# EAGLE design PIDController (EAGLE 5.10)
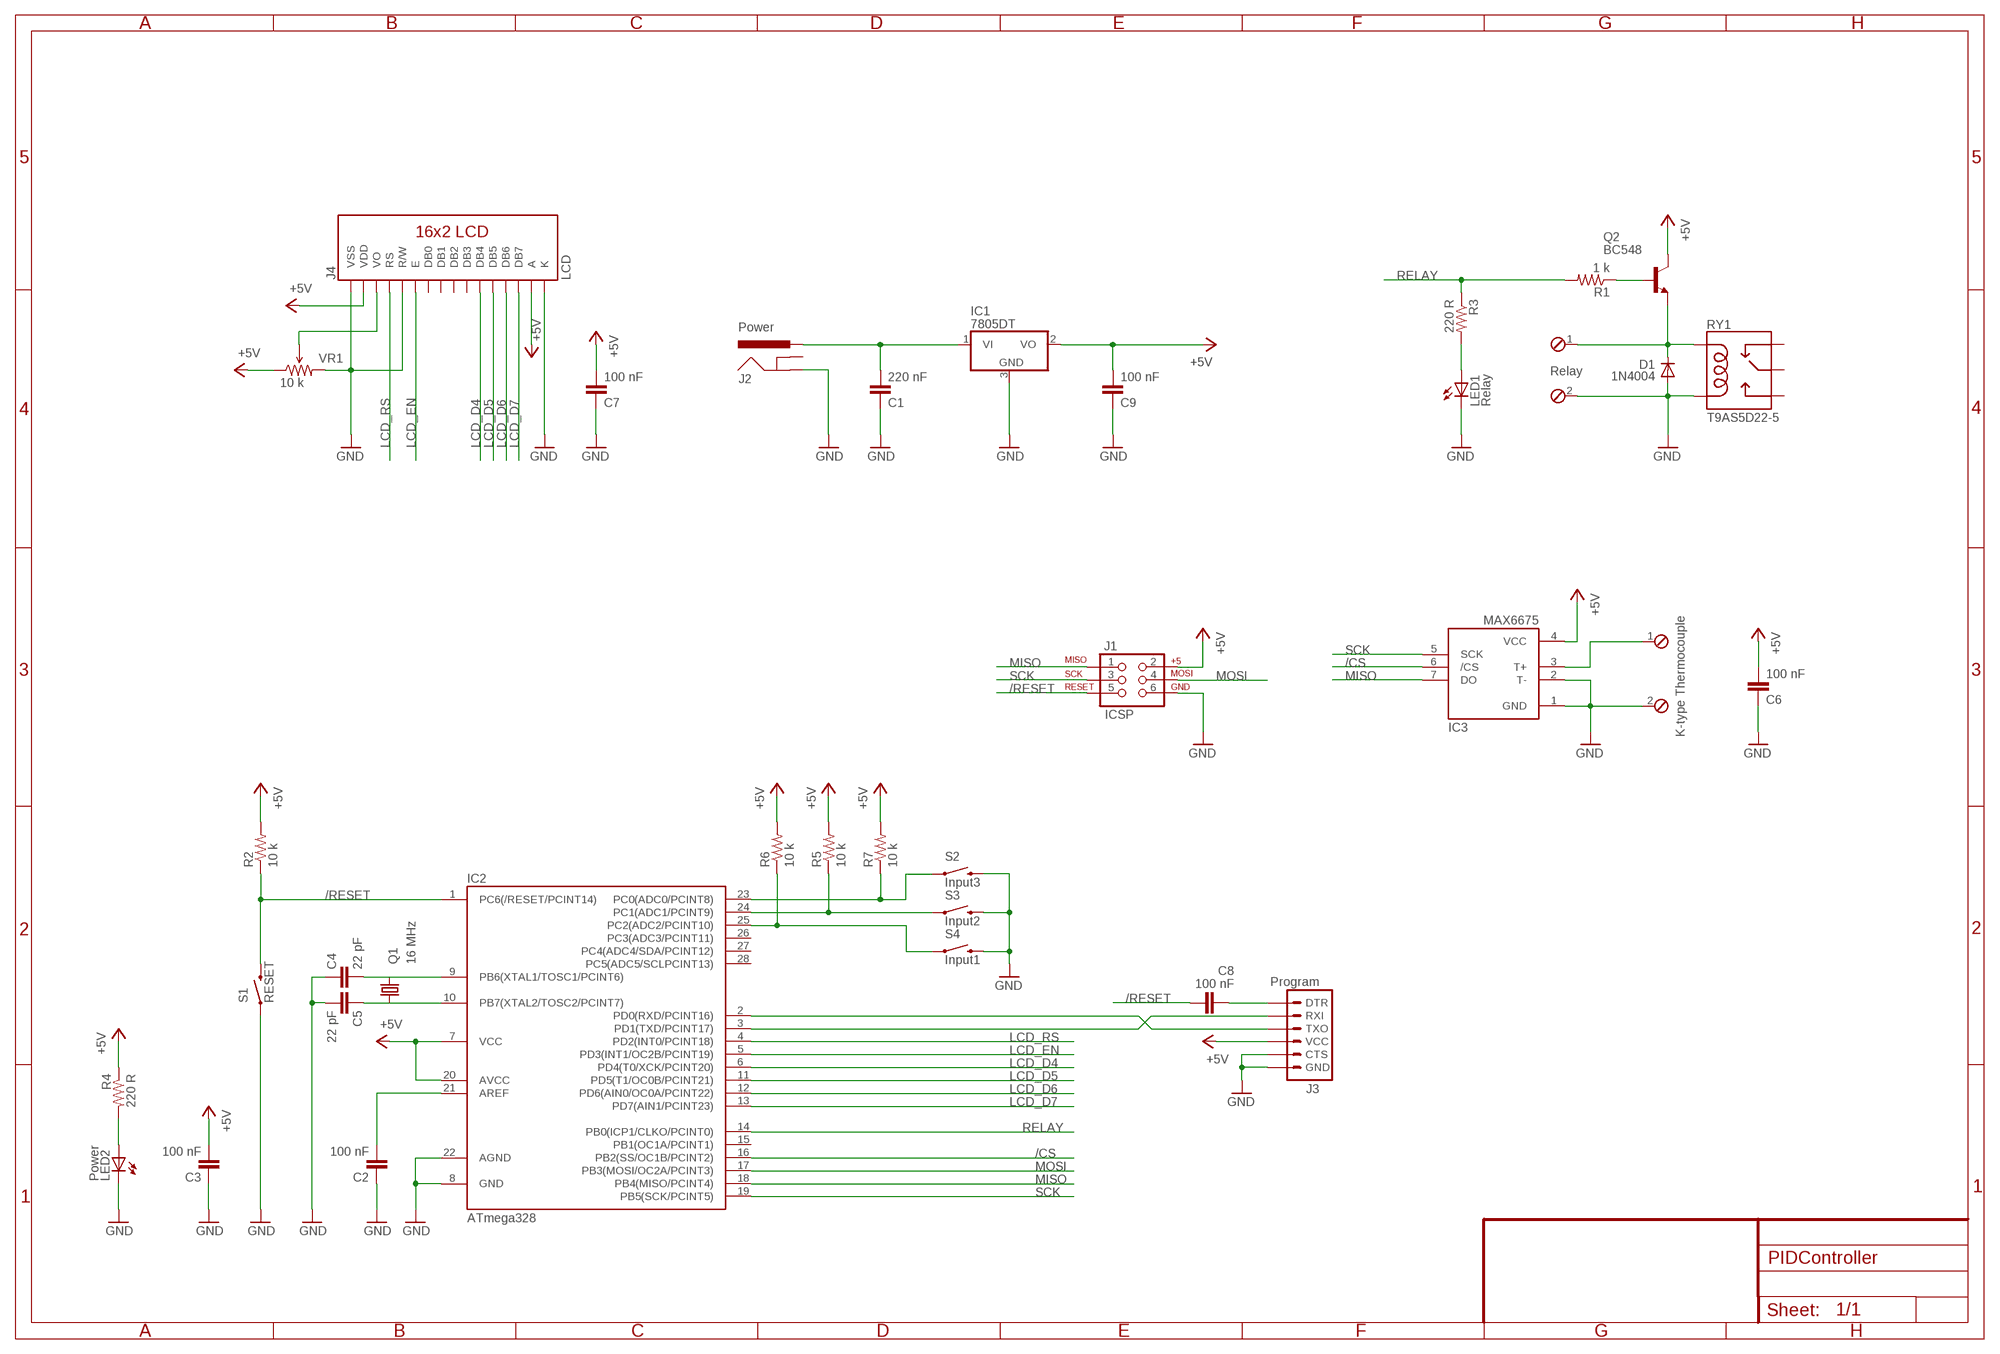
[diagram p0: schematic, sheet 1]

## Parts
C1  220 nF  C-EUC0805K  [C0805K]
C2  100 nF  C-EUC0805K  [C0805K]
C3  100 nF  C-EUC0805K  [C0805K]
C4  22 pF  C-EUC0805K  [C0805K]
C5  22 pF  C-EUC0805K  [C0805K]
C6  100 nF  C-EUC0805K  [C0805K]
C7  100 nF  C-EUC0805K  [C0805K]
C8  100 nF  C-EUC0805K  [C0805K]
C9  100 nF  C-EUC0805K  [C0805K]
D1  1N4004  DIODE-SOD123  [SOD123]
IC1  7805DT  [TO252]
IC2  ATmega328  MEGA48/88/168-PU  [DIL28-3]
IC3  MAX6675  [SO08]
J1  ICSP  AVR_SPI_PRG_6NS  [2X3-NS]
J2  Power  POWER_JACKPTH  [POWER_JACK_PTH]
J3  Program  ARDUINO_SERIAL_PROGRAMLONGPADS  [1X06_LONGPADS]
J4  LCD  LCD-16X2  [LCD-16X2]
J5  Relay  MPT2  [2POL254]
J6  K-type Thermocouple  MPT2  [2POL254]
LED1  Relay  LEDCHIP-LED0805  [CHIP-LED0805]
LED2  Power  LEDCHIP-LED0805  [CHIP-LED0805]
Q1  16 MHz  CRYSTALSMD  [HC49UP]
Q2  BC548  [TO92-EBC]
R1  1 k  R-US_M0805  [M0805]
R2  10 k  R-US_M0805  [M0805]
R3  220 R  R-US_M0805  [M0805]
R4  220 R  R-US_M0805  [M0805]
R5  10 k  R-US_M0805  [M0805]
R6  10 k  R-US_M0805  [M0805]
R7  10 k  R-US_M0805  [M0805]
RY1  T9AS5D22-5  RELAYPTH2  [RELAY-T9A]
S1  RESET  SWITCH-MOMENTARY-2SMD  [TACTILE_SWITCH_SMD]
S2  Input3  SWITCH-MOMENTARY-2SMD  [TACTILE_SWITCH_SMD]
S3  Input2  SWITCH-MOMENTARY-2SMD  [TACTILE_SWITCH_SMD]
S4  Input1  SWITCH-MOMENTARY-2SMD  [TACTILE_SWITCH_SMD]
VR1  10 k  TRIMPOTPTH  [TRIM_POT_PTH]

## Nets
+5V: C3.2 C6.2 C7.2 C9.2 IC1.2(VO) IC2.7(VCC) IC2.20(AVCC) IC3.4(VCC) J1.2 J3.4(VCC) J4.2(VDD) J4.15(A) Q2.C R2.2 R4.1 R5.2 R6.2 R7.2 VR1.1(CCW)
/CS: IC2.16(PB2(SS/OC1B/PCINT2)) IC3.6(/CS)
/RESET: C8.1 IC2.1(PC6(/RESET/PCINT14)) J1.5 R2.1 S1.3
GND: C1.1 C2.1 C3.1 C4.1 C5.2 C6.1 C7.1 C9.1 D1.A IC1.3(GND) IC2.8(GND) IC2.22(AGND) IC3.1(GND) IC3.2(T-) J1.6 J2.GND J3.5(CTS) J3.6(GND) J4.1(VSS) J4.5(R/W) J4.16(K) J5.2 J6.2 LED1.C LED2.C RY1.COIL2 S1.1 S2.3 S3.3 S4.3 VR1.3(CW)
LCD_D4: IC2.6(PD4(T0/XCK/PCINT20)) J4.11(DB4)
LCD_D5: IC2.11(PD5(T1/OC0B/PCINT21)) J4.12(DB5)
LCD_D6: IC2.12(PD6(AIN0/OC0A/PCINT22)) J4.13(DB6)
LCD_D7: IC2.13(PD7(AIN1/PCINT23)) J4.14(DB7)
LCD_EN: IC2.5(PD3(INT1/OC2B/PCINT19)) J4.6(E)
LCD_RS: IC2.4(PD2(INT0/PCINT18)) J4.4(RS)
MISO: IC2.18(PB4(MISO/PCINT4)) IC3.7(DO) J1.1
MOSI: IC2.17(PB3(MOSI/OC2A/PCINT3)) J1.4
N$1: IC2.3(PD1(TXD/PCINT17)) J3.2(RXI)
N$2: IC2.2(PD0(RXD/PCINT16)) J3.3(TXO)
N$3: IC3.3(T+) J6.1
N$4: C8.2 J3.1(DTR)
N$5: IC2.23(PC0(ADC0/PCINT8)) R7.1 S2.1
N$6: IC2.24(PC1(ADC1/PCINT9)) R5.1 S3.1
N$7: IC2.25(PC2(ADC2/PCINT10)) R6.1 S4.1
N$8: D1.C J5.1 Q2.E RY1.COIL1
N$9: Q2.B R1.1
N$10: C2.2 IC2.21(AREF)
N$11: C1.2 IC1.1(VI) J2.PWR
N$12: J4.3(VO) VR1.2(WIPER)
N$13: LED1.A R3.2
N$14: C4.2 IC2.9(PB6(XTAL1/TOSC1/PCINT6)) Q1.2
N$15: C5.1 IC2.10(PB7(XTAL2/TOSC2/PCINT7)) Q1.1
N$123: LED2.A R4.2
RELAY: IC2.14(PB0(ICP1/CLKO/PCINT0)) R1.2 R3.1
SCK: IC2.19(PB5(SCK/PCINT5)) IC3.5(SCK) J1.3
Unconnected: IC2.15(PB1(OC1A/PCINT1)) IC2.26(PC3(ADC3/PCINT11)) IC2.27(PC4(ADC4/SDA/PCINT12)) IC2.28(PC5(ADC5/SCLPCINT13)) J2.GNDBREAK J4.7(DB0) J4.8(DB1) J4.9(DB2) J4.10(DB3) RY1.MAIN RY1.NC RY1.NO

## Library data of the parts
C1-C9 = rcl:C-EU: CAPACITOR, European symbol
D1 = diode:DIODE-: DIODE
IC1 = linear:78*: Positive VOLTAGE REGULATOR Source: http://cache.national.com/ds/LM/LM78L05.pdf http://www.fairchildsemi.com/ds/LM/LM7805.pdf
IC2 = avr-5:MEGA48/88/168-PU
IC3 = adafruit:MAX6675
J1 = SparkFun:AVR_SPI_PRG_6: AVR ISP 6 Pin This is the reduced ISP connector for AVR programming. Common on Arduino. This footprint will take up less PCB space and can be used with a 10-pin to 6-pin adapter such as SKU: BOB-08508
J2 = SparkFun:POWER_JACK: Power Jack This is the standard 5.5mm barrel jack for power. The PTH is the most common, proven, reliable, footprint. All others are experimental. The Slot footprint only works if the mill layer is transmitted to the PCB fab house so be warned. Spark Fun Electronics SKU : PRT-00119. Mating wall wart : TOL-00298 (and others)
J3 = SparkFun:ARDUINO_SERIAL_PROGRAM
J4 = SparkFun:LCD-16X2
J5 J6 = con-phoenix-254:MPT2: PHOENIX CONNECTOR
LED1 LED2 = led:LED: LED OSRAM: - CHIPLED LG R971, LG N971, LY N971, LG Q971, LY Q971, LO R971, LY R971 LH N974, LH R974 LS Q976, LO Q976, LY Q976 LO Q996 - Hyper CHIPLED LW Q18S LB Q993, LB Q99A, LB R99A - SideLED LS A670, LO A670, LY A670, LG A670, LP A670 LB A673, LV A673, LT A673, LW A673 LH A674 LY A675 LS A676, LA A676, LO A676, LY A676, LW A676 LS A679, LY A679, LG A679 - Hyper Micro SIDELED® LS Y876, LA Y876, LO Y876, LY Y876 LT Y87S - SmartLED LW L88C, LW L88S LB L89C, LB L89S, LG L890 LS L89K, LO L89K, LY L89K LS L896, LA L896, LO L896, LY L896 - TOPLED LS T670, LO T670, LY T670, LG T670, LP T670 LSG T670, LSP T670, LSY T670, LOP T670, LYG T670 LG T671, LOG T671, LSG T671 LB T673, LV T673, LT T673, LW T673 LH T674 LS T676, LA T676, LO T676, LY T676, LB T676, LH T676, LSB T676, LW T676 LB T67C, LV T67C, LT T67C, LS T67K, LO T67K, LY T67K, LW E67C LS E67B, LA E67B, LO E67B, LY E67B, LB E67C, LV E67C, LT E67C LW T67C LS T679, LY T679, LG T679 LS T770, LO T770, LY T770, LG T770, LP T770 LB T773, LV T773, LT T773, LW T773 LH T774 LS E675, LA E675, LY E675, LS T675 LS T776, LA T776, LO T776, LY T776, LB T776 LHGB T686 LT T68C, LB T68C - Hyper Mini TOPLED® LB M676 - Mini TOPLED Santana® LG M470 LS M47K, LO M47K, LY M47K Source: http://www.osram.convergy.de - LUMILED® LXK2-PW12-R00, LXK2-PW12-S00, LXK2-PW14-U00, LXK2-PW14-V00 LXK2-PM12-R00, LXK2-PM12-S00, LXK2-PM14-U00 LXK2-PE12-Q00, LXK2-PE12-R00, LXK2-PE12-S00, LXK2-PE14-T00, LXK2-PE14-U00 LXK2-PB12-K00, LXK2-PB12-L00, LXK2-PB12-M00, LXK2-PB14-N00, LXK2-PB14-P00, LXK2-PB14-Q00 LXK2-PR12-L00, LXK2-PR12-M00, LXK2-PR14-Q00, LXK2-PR14-R00 LXK2-PD12-Q00, LXK2-PD12-R00, LXK2-PD12-S00 LXK2-PH12-R00, LXK2-PH12-S00 LXK2-PL12-P00, LXK2-PL12-Q00, LXK2-PL12-R00 Source: www.luxeon.com
Q1 = SparkFun:CRYSTAL: Crystals Various standard crystals. Proven footprints. Spark Fun Electronics SKU : COM-00534
Q2 = transistor-npn:BC548*: NPN Transistor
R1-R7 = resistor:R-US_: RESISTOR, American symbol
RY1 = SparkFun:RELAY
S1-S4 = SparkFun:SWITCH-MOMENTARY-2
VR1 = SparkFun:TRIMPOT

## Board
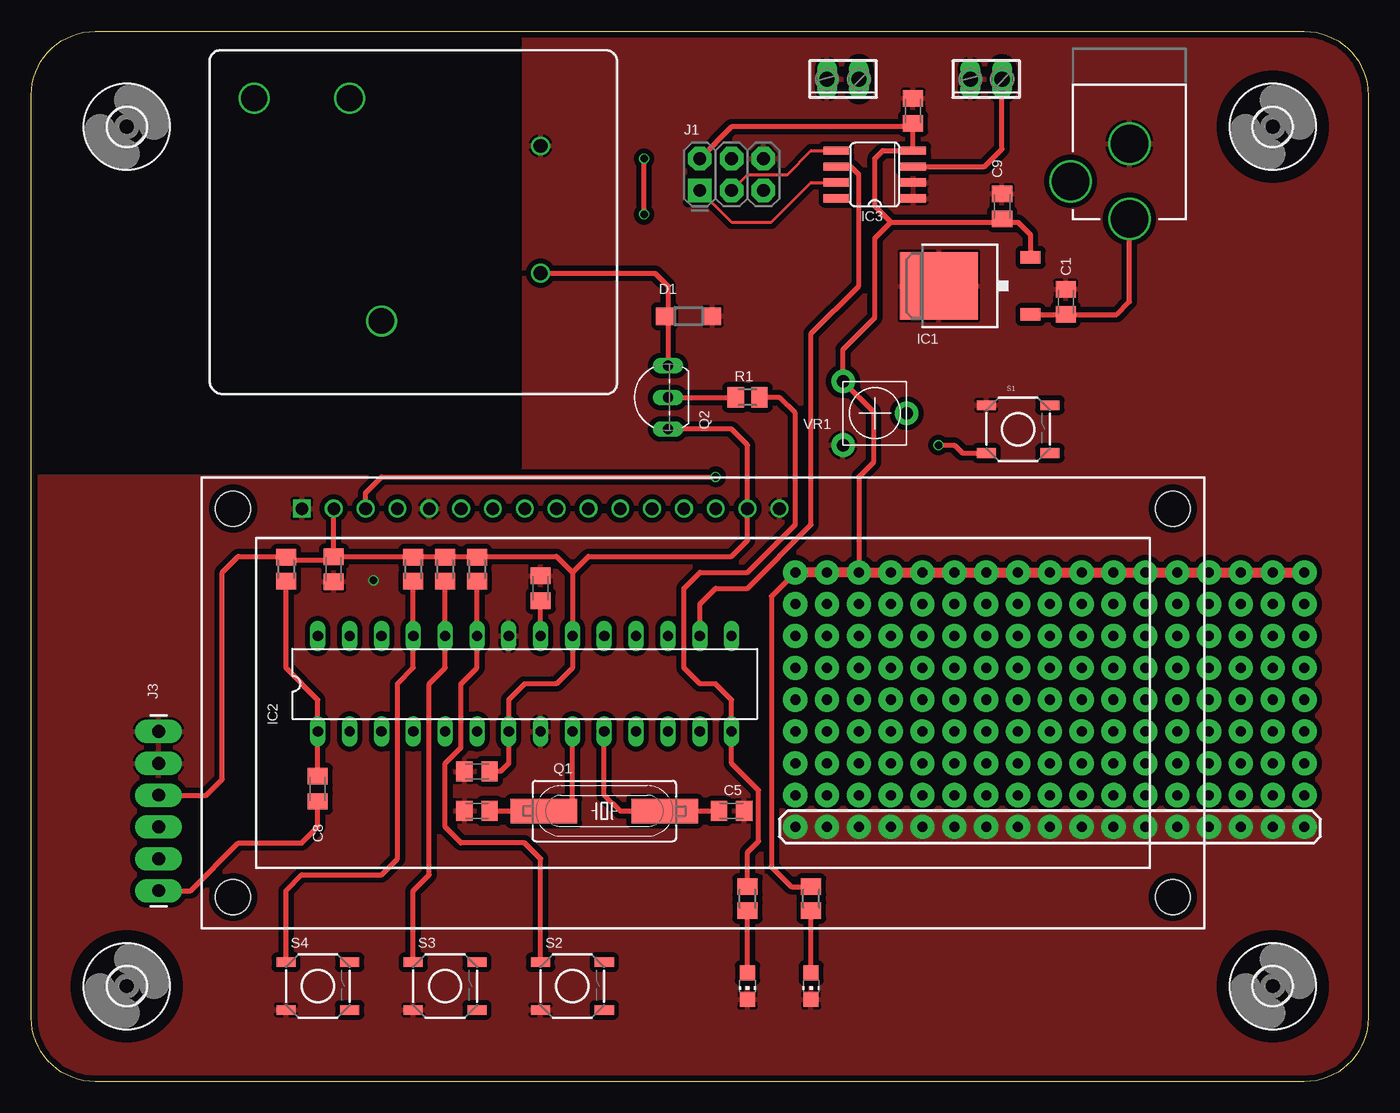
[diagram p1: board, top side]
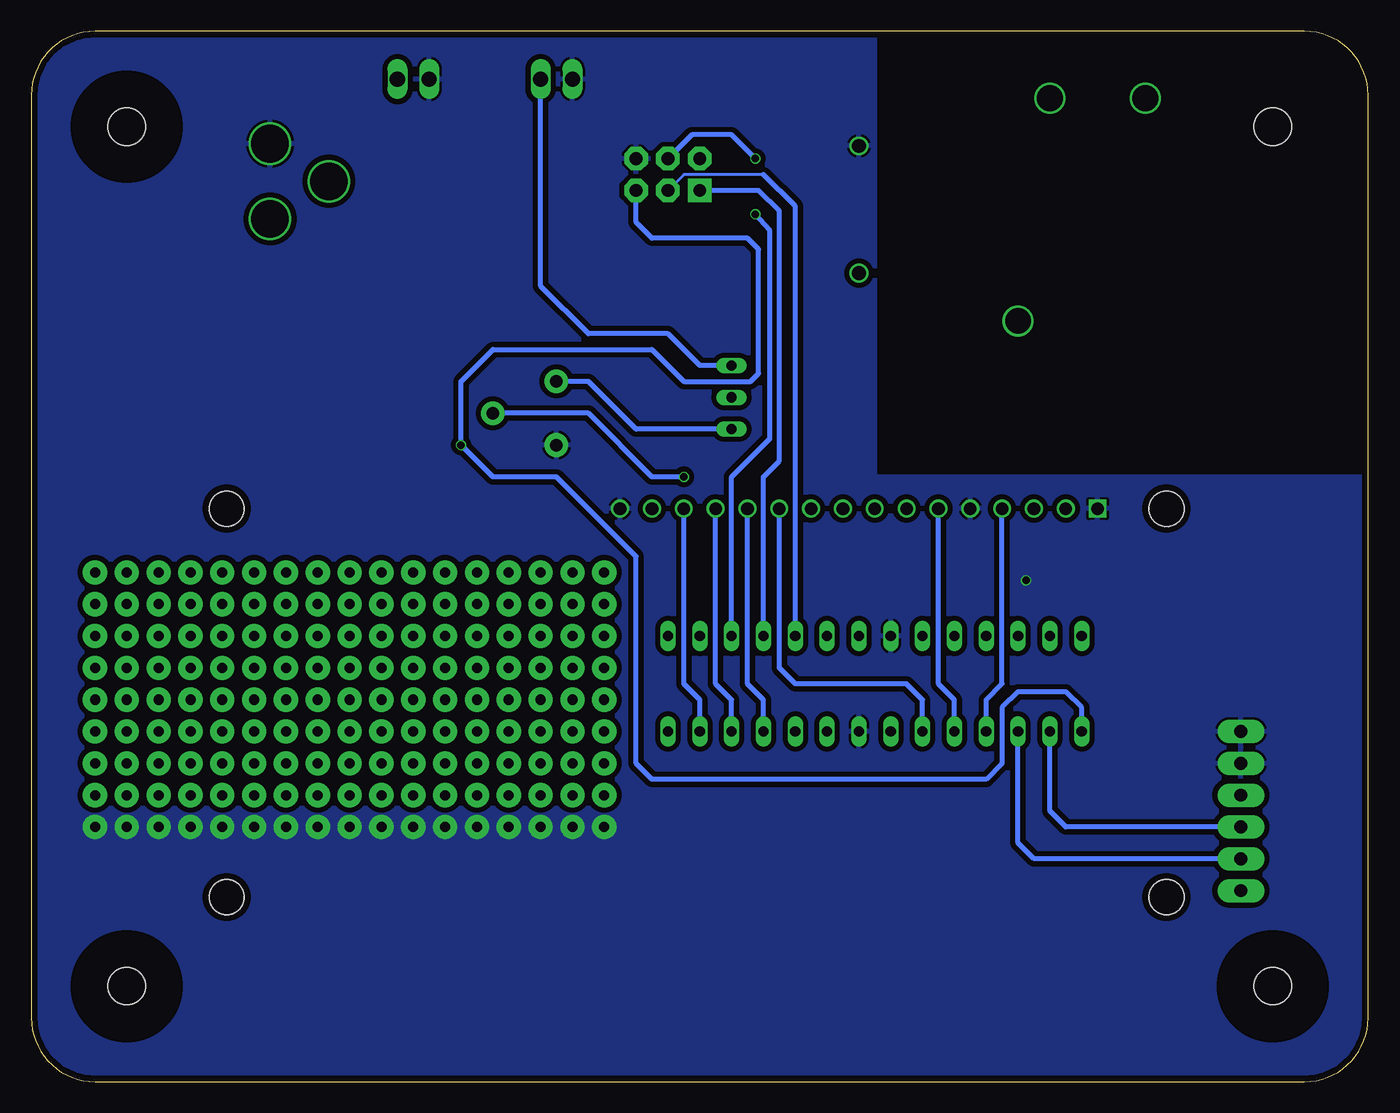
[diagram p2: board, bottom side, seen from below]

Size 106.68 x 83.82 mm. Coordinates in mm from the lower left corner, seen from the top.
Outline: 0,78.74 arc-90 5.08,83.82 101.6,83.82 arc-90 106.68,78.74 106.68,5.08 arc-90 101.6,0 5.08,0 arc-90 0,5.08 0,78.74
Copper layers (1*16): Top 0.035mm / dielectric 1.5mm / Bottom 0.035mm
Design rules "PCBCart-.3mmHoles-.1mmAnnulars": minimum track width 8mil, minimum drill 0.3mm, track to track 8mil, track to pad 8mil, pad to pad 8mil, via to via 8mil, smd to smd 8mil, copper to edge 20mil, drill to drill 8mil, minimum pad ring 8mil, minimum via ring 4mil, stop-mask expansion 3mil, vias tented up to drill 0mil, thermal gap 8mil

### Footprints (pad centres in the part's own frame; a part is rotated, then mirrored left to right if it is on the bottom)
C0805K = smd 1.3 x 1.6: 1 -1,0; 2 1,0
SOD123 = smd 1.4 x 1.4: A 1.9,0; C -1.9,0
TO252 = smd 1 x 1.6: 1 -2.28,-4.8; 2 2.28,-4.8 | smd 5.4 x 6.2: 3 0,2.5
DIL28-3 = drill 0.813 long: 1 -16.51,-3.81; 2 -13.97,-3.81; 3 -11.43,-3.81; 4 -8.89,-3.81; 5 -6.35,-3.81; 6 -3.81,-3.81; 7 -1.27,-3.81; 8 1.27,-3.81; 9 3.81,-3.81; 10 6.35,-3.81; 11 8.89,-3.81; 12 11.43,-3.81; 13 13.97,-3.81; 14 16.51,-3.81; 15 16.51,3.81; 16 13.97,3.81; 17 11.43,3.81; 18 8.89,3.81; 19 6.35,3.81; 20 3.81,3.81; 21 1.27,3.81; 22 -1.27,3.81; 23 -3.81,3.81; 24 -6.35,3.81; 25 -8.89,3.81; 26 -11.43,3.81; 27 -13.97,3.81; 28 -16.51,3.81
SO08 = smd 0.66 x 2.032: 1 -1.905,-3.073; 2 -0.635,-3.073; 3 0.635,-3.073; 4 1.905,-3.073; 5 1.905,3.073; 6 0.635,3.073; 7 -0.635,3.073; 8 -1.905,3.073
2X3-NS = drill 1.016 pad 1.88 square: 1 -2.54,-1.27 | drill 1.016 pad 1.88 octagon: 2 -2.54,1.27; 3 0,-1.27; 4 0,1.27; 5 2.54,-1.27; 6 2.54,1.27
POWER_JACK_PTH = drill 2.997 round: GND 0,7.7; GNDBREAK 4.7,10.7; PWR 0,13.7
1X06_LONGPADS = drill 1.016 pad 1.88 long: 1 0,0; 2 2.54,0; 3 5.08,0; 4 7.62,0; 5 10.16,0; 6 12.7,0
LCD-16X2 = drill 1.016 square: 1 -32,15.5 | drill 1.016 round: 2 -29.46,15.5; 3 -26.92,15.5; 4 -24.38,15.5; 5 -21.84,15.5; 6 -19.3,15.5; 7 -16.76,15.5; 8 -14.22,15.5; 9 -11.68,15.5; 10 -9.14,15.5; 11 -6.6,15.5; 12 -4.06,15.5; 13 -1.52,15.5; 14 1.02,15.5; 15 3.56,15.5; 16 6.1,15.5 | hole 2.8: -37.5,15.5; -37.5,-15.5; 37.5,15.5; 37.5,-15.5
2POL254 = drill 1.2 long: 1 -1.27,0; 2 1.27,0
CHIP-LED0805 = smd 1.2 x 1.2: A 0,-1.05; C 0,1.05
HC49UP = smd 5.334 x 1.93: 1 -4.826,0; 2 4.826,0
TO92-EBC = drill 0.813 long: B 0,-1.27; C -2.54,-1.27; E 2.54,-1.27
M0805 = smd 1.3 x 1.6: 1 -0.95,0; 2 0.95,0
RELAY-T9A = drill 1.092 round: COIL1 -4.064,-10.16; COIL2 6.096,-10.16 | drill 2.057 round: MAIN -7.874,2.54; NC 9.906,12.7; NO 9.906,5.08
TACTILE_SWITCH_SMD = smd 1.524 x 0.762: 1 -2.54,1.905; 2 2.54,1.905; 3 -2.54,-1.905; 4 2.54,-1.905
3,0 = hole 3: 0,0
TRIM_POT_PTH = drill 1 pad 1.88 round: 1 -2.54,-2.54; 2 0,2.54; 3 2.54,-2.54

### Placement (x,y rotation side)
C1  82.55,62.23 270 top
C2  40.64,39.37 270 top
C3  35.56,24.77 0 top
C4  35.56,21.59 0 top
C5  55.88,21.59 0 top
C6  70.36,77.47 270 top
C7  24.13,40.89 90 top
C8  22.86,23.37 270 top
C9  77.47,69.85 270 top
D1  52.45,61.09 0 top
IC1  74.93,63.5 90 top
IC2  39.37,31.75 0 top
IC3  67.31,72.39 90 top
J1  55.88,72.39 0 top
J2  87.63,82.55 180 top
J3  10.16,15.24 90 top
J4  53.59,30.23 0 top
J5  64.77,80.01 180 top
J6  76.2,80.01 180 top
LED1  57.15,7.62 180 top
LED2  62.23,7.62 180 top
Q1  45.72,21.59 180 top
Q2  49.53,54.61 90 top
R1  57.15,54.61 0 top
R2  20.32,40.89 90 top
R3  57.15,14.61 270 top
R4  62.23,14.61 270 top
R5  33.02,40.89 90 top
R6  30.48,40.89 90 top
R7  35.56,40.89 90 top
RY1  30.48,68.58 90 top
S1  78.74,52.07 0 top
S2  43.18,7.62 0 top
S3  33.02,7.62 0 top
S4  22.86,7.62 0 top
U$1  [3,0]  99.06,76.2 0 top
U$2  [3,0]  99.06,7.62 0 top
U$3  [3,0]  7.62,7.62 0 top
U$4  [3,0]  7.62,76.2 0 top
VR1  67.31,53.34 270 top

### Tracks (layer width: path | path; a pad name or v marks a point on that pad's centre or on a via)
+5V  (via drill 0.8 pad 1.93)
  Top 0.406: 43.18,40.64 44.45,41.91 55.88,41.91 57.15,43.18 J4.15 57.15,50.8 55.88,52.07 Q2.C | 43.18,40.64 IC2.20 43.18,33.02 41.91,31.75 39.37,31.75 38.1,30.48 IC2.7 38.1,25.4 37.47,24.77 C3.2 | 43.18,40.64 41.91,41.91 35.56,41.91 | 24.13,41.64 J4.2 | 24.13,41.64 C7.2 24.15,41.91 30.48,41.91 | 30.48,41.91 33.02,41.91 | 33.02,41.91 35.56,41.91 | 24.13,41.64 20.52,41.64 R2.2 20.25,41.91 16.51,41.91 15.24,40.64 15.24,24.13 13.97,22.86 J3.4 | J1.2 55.88,76.2 70.09,76.2 C6.2 70.36,74.32 IC3.4 67.94,74.3 67.31,73.66 67.31,69.85 68.58,68.58 | IC1.2 79.73,67.59 78.74,68.58 77.74,68.58 | 68.58,68.58 77.74,68.58 | 68.58,68.58 67.31,67.31 67.31,60.96 64.77,58.42 VR1.1 67.18,53.47 67.18,49.4 66.04,48.26 v66.04,40.64 | 77.74,68.58 C9.2 | R4.1 60.64,15.55 59.06,17.14 59.06,38.73 v60.96,40.64 | 30.48,41.91 R6.2 | 35.56,41.91 R7.2 | 33.02,41.91 R5.2
  Top 0.813: v101.6,40.64 v99.06,40.64 v96.52,40.64 v93.98,40.64 v91.44,40.64 v88.9,40.64 v86.36,40.64 v83.82,40.64 v81.28,40.64 v78.74,40.64 v76.2,40.64 v73.66,40.64 v71.12,40.64 v68.58,40.64 v66.04,40.64 v63.5,40.64 v60.96,40.64
  Bottom 0.406: VR1.1 62.23,55.88 58.42,52.07 Q2.C
/CS
  Top 0.406: IC2.16 53.34,38.1 54.61,39.37 57.15,39.37 62.23,44.45 62.23,59.69 66.04,63.5 66.04,72.39 65.41,73.02 IC3.6
/RESET  (via drill 0.6)
  Top 0.406: R2.1 20.32,33.02 22.86,30.48 IC2.1 C8.1 | S1.3 74.3,50.16 73.66,50.8 v72.39,50.8
  Bottom 0.406: IC2.1 22.86,29.84 24.13,31.12 27.94,31.12 29.21,29.84 29.21,25.4 30.48,24.13 57.15,24.13 58.42,25.4 58.42,41.91 64.77,48.26 69.85,48.26 v72.39,50.8 72.39,55.88 69.85,58.42 57.15,58.42 54.61,55.88 49.28,55.88 48.64,56.52 48.64,66.42 49.53,67.31 57.15,67.31 58.42,68.58 J1.5
GND  (via drill 0.6, 0.8 pad 1.93)
  other vias: 27.3,40 60.96,20.32 63.5,20.32 66.04,20.32 68.58,20.32 71.12,20.32 73.66,20.32 76.2,20.32 78.74,20.32 81.28,20.32 99.06,20.32 101.6,20.32 83.82,20.32 86.36,20.32 88.9,20.32 91.44,20.32 93.98,20.32 96.52,20.32
  pour Bottom (isolate 0.406): -2.54,-1.27 -2.54,48.26 39.37,48.26 39.37,85.09 107.95,85.09 107.95,-1.27
  pour Top (isolate 0.406): -2.54,48.26 39.37,48.26 39.37,85.09 107.95,85.09 107.95,-1.27 -2.54,-1.27
LCD_D4
  Bottom 0.406: IC2.6 35.56,30.48 36.83,31.75 45.72,31.75 46.99,33.02 J4.11
LCD_D5
  Bottom 0.406: IC2.11 48.26,30.48 49.53,31.75 J4.12
LCD_D6
  Bottom 0.406: IC2.12 50.8,30.48 52.07,31.75 J4.13
LCD_D7
  Bottom 0.406: IC2.13 53.34,30.48 54.61,31.75 J4.14
LCD_EN
  Bottom 0.406: J4.6 34.29,31.75 33.02,30.48 IC2.5
LCD_RS
  Bottom 0.406: J4.4 29.21,31.75 30.48,30.48 IC2.4
MISO
  Top 0.254: J1.1 55.88,68.58 59.06,68.58 62.23,71.75 IC3.7
  Bottom 0.406: IC2.18 48.26,48.26 46.99,49.53 46.99,69.47 48.64,71.12 J1.1
MOSI  (via drill 0.6)
  Top 0.406: v48.89,69.22 v48.89,73.66
  Bottom 0.406: IC2.17 50.8,48.26 47.75,51.31 47.75,67.95 v48.89,69.22 | J1.4 53.97,75.56 50.8,75.56 v48.89,73.66
N$1
  Bottom 0.406: J3.2 26.67,17.78 27.94,19.05 IC2.3
N$2
  Bottom 0.406: J3.3 24.13,20.32 25.4,21.59 IC2.2
N$3
  Top 0.406: IC3.3 76.07,73.02 77.47,74.42 J6.1
N$4
  Top 0.406: J3.1 12.7,15.24 16.51,19.05 21.59,19.05 22.86,20.32 C8.2
N$5
  Top 0.406: S2.1 40.64,17.78 39.37,19.05 34.29,19.05 33.02,20.32 33.02,25.4 34.29,26.67 34.29,31.75 35.56,33.02 IC2.23 R7.1
N$6
  Top 0.406: S3.1 30.48,15.24 31.75,16.51 31.75,31.75 33.02,33.02 IC2.24 R5.1
N$7
  Top 0.406: S4.1 20.32,15.24 21.59,16.51 27.94,16.51 29.21,17.78 29.21,31.75 30.48,33.02 IC2.25 R6.1
N$8
  Top 0.406: RY1.COIL1 49.78,64.52 50.8,63.5 50.8,61.34 | 50.8,61.34 Q2.E | 50.8,61.34 D1.C
  Bottom 0.406: Q2.E 53.34,57.15 55.88,59.69 62.23,59.69 66.04,63.5 J5.1
N$9
  Top 0.406: Q2.B R1.1
N$10
  Top 0.406: IC2.21 C2.2
N$11
  Top 0.406: J2.PWR 87.63,62.23 86.62,61.22 IC1.1 C1.2
N$12  (via drill 0.6)
  Top 0.406: v54.61,48.26 27.94,48.26 26.67,46.99 J4.3
  Bottom 0.406: VR1.2 62.23,53.34 57.15,48.26 v54.61,48.26
N$13
  Top 0.406: LED1.A R3.2
N$14
  Top 0.406: IC2.9 43.18,21.59 Q1.2 C4.2
N$15
  Top 0.406: IC2.10 45.72,22.86 46.99,21.59 Q1.1 C5.1
N$16  (via drill 0.8 pad 1.93)
  other vias: 83.82,35.56
N$17  (via drill 0.8 pad 1.93)
  other vias: 99.06,38.1
N$18  (via drill 0.8 pad 1.93)
  other vias: 101.6,38.1
N$19  (via drill 0.8 pad 1.93)
  other vias: 81.28,38.1
N$20  (via drill 0.8 pad 1.93)
  other vias: 83.82,33.02
N$21  (via drill 0.8 pad 1.93)
  other vias: 83.82,30.48
N$22  (via drill 0.8 pad 1.93)
  other vias: 86.36,30.48
N$23  (via drill 0.8 pad 1.93)
  other vias: 78.74,38.1
N$24  (via drill 0.8 pad 1.93)
  other vias: 76.2,38.1
N$25  (via drill 0.8 pad 1.93)
  other vias: 86.36,33.02
N$26  (via drill 0.8 pad 1.93)
  other vias: 86.36,35.56
N$27  (via drill 0.8 pad 1.93)
  other vias: 73.66,38.1
N$28  (via drill 0.8 pad 1.93)
  other vias: 71.12,38.1
N$29  (via drill 0.8 pad 1.93)
  other vias: 88.9,35.56
N$30  (via drill 0.8 pad 1.93)
  other vias: 88.9,33.02
N$31  (via drill 0.8 pad 1.93)
  other vias: 68.58,38.1
N$32  (via drill 0.8 pad 1.93)
  other vias: 66.04,38.1
N$33  (via drill 0.8 pad 1.93)
  other vias: 88.9,30.48
N$34  (via drill 0.8 pad 1.93)
  other vias: 60.96,38.1
N$36  (via drill 0.8 pad 1.93)
  other vias: 60.96,33.02
N$37  (via drill 0.8 pad 1.93)
  other vias: 63.5,33.02
N$38  (via drill 0.8 pad 1.93)
  other vias: 63.5,35.56
N$39  (via drill 0.8 pad 1.93)
  other vias: 66.04,33.02
N$40  (via drill 0.8 pad 1.93)
  other vias: 68.58,33.02
N$41  (via drill 0.8 pad 1.93)
  other vias: 68.58,35.56
N$42  (via drill 0.8 pad 1.93)
  other vias: 71.12,35.56
N$43  (via drill 0.8 pad 1.93)
  other vias: 71.12,33.02
N$44  (via drill 0.8 pad 1.93)
  other vias: 73.66,33.02
N$45  (via drill 0.8 pad 1.93)
  other vias: 73.66,35.56
N$46  (via drill 0.8 pad 1.93)
  other vias: 76.2,35.56
N$47  (via drill 0.8 pad 1.93)
  other vias: 76.2,33.02
N$48  (via drill 0.8 pad 1.93)
  other vias: 78.74,33.02
N$49  (via drill 0.8 pad 1.93)
  other vias: 83.82,38.1
N$50  (via drill 0.8 pad 1.93)
  other vias: 81.28,35.56
N$51  (via drill 0.8 pad 1.93)
  other vias: 81.28,33.02
N$52  (via drill 0.8 pad 1.93)
  other vias: 60.96,30.48
N$53  (via drill 0.8 pad 1.93)
  other vias: 63.5,30.48
N$54  (via drill 0.8 pad 1.93)
  other vias: 66.04,30.48
N$55  (via drill 0.8 pad 1.93)
  other vias: 68.58,30.48
N$56  (via drill 0.8 pad 1.93)
  other vias: 71.12,30.48
N$57  (via drill 0.8 pad 1.93)
  other vias: 73.66,30.48
N$58  (via drill 0.8 pad 1.93)
  other vias: 76.2,30.48
N$59  (via drill 0.8 pad 1.93)
  other vias: 78.74,30.48
N$60  (via drill 0.8 pad 1.93)
  other vias: 81.28,30.48
N$61  (via drill 0.8 pad 1.93)
  other vias: 99.06,30.48
N$62  (via drill 0.8 pad 1.93)
  other vias: 99.06,33.02
N$63  (via drill 0.8 pad 1.93)
  other vias: 99.06,35.56
N$64  (via drill 0.8 pad 1.93)
  other vias: 101.6,35.56
N$65  (via drill 0.8 pad 1.93)
  other vias: 101.6,33.02
N$66  (via drill 0.8 pad 1.93)
  other vias: 101.6,30.48
N$67  (via drill 0.8 pad 1.93)
  other vias: 60.96,27.94
N$68  (via drill 0.8 pad 1.93)
  other vias: 60.96,25.4
N$69  (via drill 0.8 pad 1.93)
  other vias: 60.96,22.86
N$70  (via drill 0.8 pad 1.93)
  other vias: 83.82,27.94
N$71  (via drill 0.8 pad 1.93)
  other vias: 86.36,27.94
N$72  (via drill 0.8 pad 1.93)
  other vias: 63.5,22.86
N$73  (via drill 0.8 pad 1.93)
  other vias: 63.5,25.4
N$74  (via drill 0.8 pad 1.93)
  other vias: 63.5,27.94
N$75  (via drill 0.8 pad 1.93)
  other vias: 66.04,27.94
N$76  (via drill 0.8 pad 1.93)
  other vias: 66.04,25.4
N$77  (via drill 0.8 pad 1.93)
  other vias: 68.58,25.4
N$78  (via drill 0.8 pad 1.93)
  other vias: 68.58,27.94
N$79  (via drill 0.8 pad 1.93)
  other vias: 101.6,27.94
N$80  (via drill 0.8 pad 1.93)
  other vias: 101.6,25.4
N$81  (via drill 0.8 pad 1.93)
  other vias: 101.6,22.86
N$82  (via drill 0.8 pad 1.93)
  other vias: 88.9,27.94
N$83  (via drill 0.8 pad 1.93)
  other vias: 91.44,33.02
N$84  (via drill 0.8 pad 1.93)
  other vias: 91.44,35.56
N$85  (via drill 0.8 pad 1.93)
  other vias: 91.44,30.48
N$86  (via drill 0.8 pad 1.93)
  other vias: 91.44,27.94
N$87  (via drill 0.8 pad 1.93)
  other vias: 93.98,35.56
N$88  (via drill 0.8 pad 1.93)
  other vias: 96.52,35.56
N$89  (via drill 0.8 pad 1.93)
  other vias: 93.98,27.94
N$90  (via drill 0.8 pad 1.93)
  other vias: 93.98,30.48
N$91  (via drill 0.8 pad 1.93)
  other vias: 66.04,22.86
N$92  (via drill 0.8 pad 1.93)
  other vias: 68.58,22.86
N$93  (via drill 0.8 pad 1.93)
  other vias: 71.12,22.86
N$94  (via drill 0.8 pad 1.93)
  other vias: 73.66,22.86
N$95  (via drill 0.8 pad 1.93)
  other vias: 76.2,22.86
N$96  (via drill 0.8 pad 1.93)
  other vias: 76.2,25.4
N$97  (via drill 0.8 pad 1.93)
  other vias: 76.2,27.94
N$98  (via drill 0.8 pad 1.93)
  other vias: 73.66,27.94
N$99  (via drill 0.8 pad 1.93)
  other vias: 73.66,25.4
N$100  (via drill 0.8 pad 1.93)
  other vias: 71.12,25.4
N$101  (via drill 0.8 pad 1.93)
  other vias: 71.12,27.94
N$102  (via drill 0.8 pad 1.93)
  other vias: 78.74,27.94
N$103  (via drill 0.8 pad 1.93)
  other vias: 78.74,25.4
N$104  (via drill 0.8 pad 1.93)
  other vias: 78.74,22.86
N$105  (via drill 0.8 pad 1.93)
  other vias: 81.28,22.86
N$106  (via drill 0.8 pad 1.93)
  other vias: 81.28,25.4
N$107  (via drill 0.8 pad 1.93)
  other vias: 81.28,27.94
N$108  (via drill 0.8 pad 1.93)
  other vias: 99.06,27.94
N$109  (via drill 0.8 pad 1.93)
  other vias: 99.06,25.4
N$110  (via drill 0.8 pad 1.93)
  other vias: 99.06,22.86
N$111  (via drill 0.8 pad 1.93)
  other vias: 93.98,33.02
N$112  (via drill 0.8 pad 1.93)
  other vias: 96.52,33.02
N$113  (via drill 0.8 pad 1.93)
  other vias: 96.52,30.48
N$114  (via drill 0.8 pad 1.93)
  other vias: 96.52,27.94
N$115  (via drill 0.8 pad 1.93)
  other vias: 83.82,25.4
N$116  (via drill 0.8 pad 1.93)
  other vias: 86.36,25.4
N$117  (via drill 0.8 pad 1.93)
  other vias: 86.36,22.86
N$118  (via drill 0.8 pad 1.93)
  other vias: 83.82,22.86
N$119  (via drill 0.8 pad 1.93)
  other vias: 88.9,22.86
N$120  (via drill 0.8 pad 1.93)
  other vias: 88.9,25.4
N$121  (via drill 0.8 pad 1.93)
  other vias: 91.44,25.4
N$122  (via drill 0.8 pad 1.93)
  other vias: 91.44,22.86
N$123
  Top 0.406: LED2.A R4.2
N$125  (via drill 0.8 pad 1.93)
  other vias: 66.04,35.56
N$126  (via drill 0.8 pad 1.93)
  other vias: 60.96,35.56
N$127  (via drill 0.8 pad 1.93)
  other vias: 63.5,38.1
N$128  (via drill 0.8 pad 1.93)
  other vias: 93.98,22.86
N$129  (via drill 0.8 pad 1.93)
  other vias: 93.98,25.4
N$130  (via drill 0.8 pad 1.93)
  other vias: 96.52,25.4
N$131  (via drill 0.8 pad 1.93)
  other vias: 96.52,22.86
N$133  (via drill 0.8 pad 1.93)
  other vias: 78.74,35.56
N$134  (via drill 0.8 pad 1.93)
  other vias: 86.36,38.1
N$135  (via drill 0.8 pad 1.93)
  other vias: 88.9,38.1
N$136  (via drill 0.8 pad 1.93)
  other vias: 93.98,38.1
N$137  (via drill 0.8 pad 1.93)
  other vias: 91.44,38.1
N$259  (via drill 0.8 pad 1.93)
  other vias: 96.52,38.1
RELAY
  Top 0.406: R1.2 59.69,54.61 60.96,53.34 60.96,44.45 57.15,40.64 53.34,40.64 52.07,39.37 52.07,33.02 53.34,31.75 54.61,31.75 55.88,30.48 IC2.14 55.88,25.4 58.04,23.24 58.04,19.18 57.15,18.29 R3.1
SCK
  Top 0.254: J1.3 57.15,72.39 60.33,72.39 62.23,74.3 IC3.5
  Bottom 0.254: 48.26,72.39 54.61,72.39 J1.3
  Bottom 0.406: IC2.19 45.72,69.85 48.26,72.39

### Text on the board
Document: - | + | - | + | 7-15 V DC | MAX RELAY LOAD: 15 A 240 VAC | 16 | +5V | GND | GND | +5 V | RXD | GND | TXD | DTR | Programmable Heater Controller v. 0.5